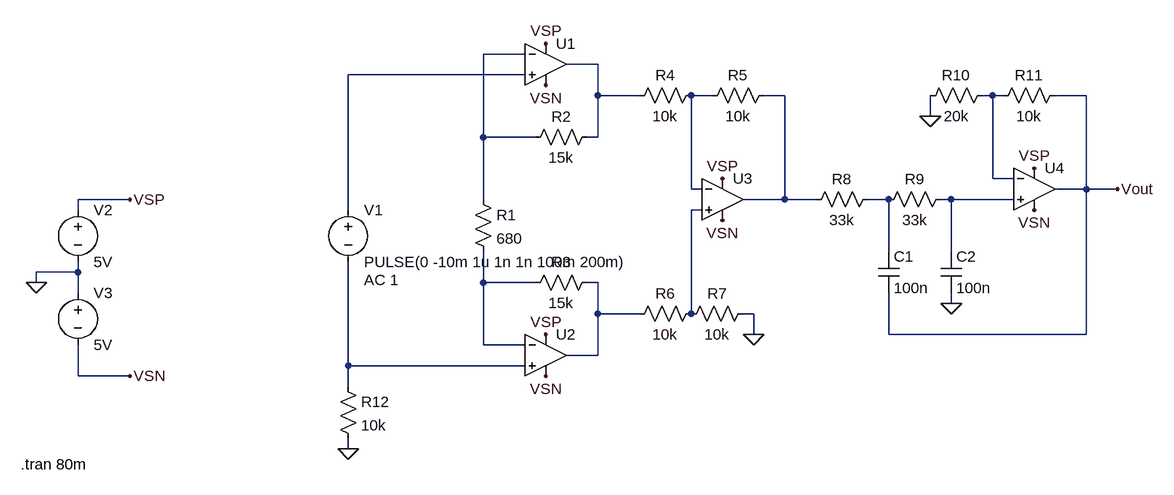
[diagram p0: schematic ex4.asc]
ex4.asc, the LTspice schematic file:
Version 4
SHEET 1 1612 680
WIRE 544 -208 480 -208
WIRE 656 -192 608 -192
WIRE 544 -176 272 -176
WIRE 656 -144 656 -192
WIRE 720 -144 656 -144
WIRE 832 -144 800 -144
WIRE 944 -144 912 -144
WIRE 1264 -144 1248 -144
WIRE 1280 -144 1264 -144
WIRE 1408 -144 1360 -144
WIRE 1168 -112 1168 -144
WIRE 480 -80 480 -208
WIRE 560 -80 480 -80
WIRE 656 -80 656 -144
WIRE 656 -80 640 -80
WIRE 1264 -16 1264 -144
WIRE 1296 -16 1264 -16
WIRE 800 0 800 -144
WIRE 816 0 800 0
WIRE 1408 0 1408 -144
WIRE 1408 0 1360 0
WIRE 1456 0 1408 0
WIRE -64 16 -144 16
WIRE 480 16 480 -80
WIRE 944 16 944 -144
WIRE 944 16 880 16
WIRE 992 16 944 16
WIRE 1104 16 1072 16
WIRE 1200 16 1184 16
WIRE 1296 16 1200 16
WIRE -144 32 -144 16
WIRE 272 32 272 -176
WIRE 816 32 800 32
WIRE 1104 96 1104 16
WIRE 1200 96 1200 16
WIRE -144 128 -144 112
WIRE -144 128 -208 128
WIRE -208 144 -208 128
WIRE 480 144 480 96
WIRE 560 144 480 144
WIRE 656 144 640 144
WIRE -144 160 -144 128
WIRE 1200 176 1200 160
WIRE 656 192 656 144
WIRE 720 192 656 192
WIRE 800 192 800 32
WIRE 896 192 880 192
WIRE 896 224 896 192
WIRE 1104 224 1104 160
WIRE 1408 224 1408 0
WIRE 1408 224 1104 224
WIRE 480 240 480 144
WIRE 544 240 480 240
WIRE 656 256 656 192
WIRE 656 256 608 256
WIRE 272 272 272 112
WIRE 544 272 272 272
WIRE -144 288 -144 240
WIRE -64 288 -144 288
WIRE 272 304 272 272
WIRE 272 400 272 384
FLAG -208 144 0
FLAG -64 16 VSP
FLAG -64 288 VSN
FLAG 272 400 0
FLAG 576 288 VSN
FLAG 576 -160 VSN
FLAG 576 -224 VSP
FLAG 576 224 VSP
FLAG 848 -16 VSP
FLAG 848 48 VSN
FLAG 896 224 0
FLAG 1200 176 0
FLAG 1328 -32 VSP
FLAG 1328 32 VSN
FLAG 1168 -112 0
FLAG 1456 0 Vout
SYMBOL voltage -144 16 R0
SYMATTR InstName V2
SYMATTR Value 5V
SYMBOL voltage -144 144 R0
SYMATTR InstName V3
SYMATTR Value 5V
SYMBOL res 256 288 R0
SYMATTR InstName R12
SYMATTR Value 10k
SYMBOL voltage 272 16 R0
WINDOW 123 24 124 Left 2
WINDOW 39 0 0 Left 0
SYMATTR Value2 AC 1
SYMATTR InstName V1
SYMATTR Value PULSE(0 -10m 1u 1n 1n 100m 200m)
SYMBOL res 464 0 R0
SYMATTR InstName R1
SYMATTR Value 680
SYMBOL res 656 -96 R90
WINDOW 0 0 56 VBottom 2
WINDOW 3 32 56 VTop 2
SYMATTR InstName R2
SYMATTR Value 15k
SYMBOL res 656 128 R90
WINDOW 0 0 56 VBottom 2
WINDOW 3 32 56 VTop 2
SYMATTR InstName R3
SYMATTR Value 15k
SYMBOL res 816 -160 R90
WINDOW 0 0 56 VBottom 2
WINDOW 3 32 56 VTop 2
SYMATTR InstName R4
SYMATTR Value 10k
SYMBOL res 816 176 R90
WINDOW 0 0 56 VBottom 2
WINDOW 3 32 56 VTop 2
SYMATTR InstName R6
SYMATTR Value 10k
SYMBOL res 928 -160 R90
WINDOW 0 0 56 VBottom 2
WINDOW 3 32 56 VTop 2
SYMATTR InstName R5
SYMATTR Value 10k
SYMBOL res 896 176 R90
WINDOW 0 0 56 VBottom 2
WINDOW 3 32 56 VTop 2
SYMATTR InstName R7
SYMATTR Value 10k
SYMBOL res 1088 0 R90
WINDOW 0 0 56 VBottom 2
WINDOW 3 32 56 VTop 2
SYMATTR InstName R8
SYMATTR Value 33k
SYMBOL cap 1088 96 R0
SYMATTR InstName C1
SYMATTR Value 100n
SYMBOL res 1200 0 R90
WINDOW 0 0 56 VBottom 2
WINDOW 3 32 56 VTop 2
SYMATTR InstName R9
SYMATTR Value 33k
SYMBOL cap 1184 96 R0
SYMATTR InstName C2
SYMATTR Value 100n
SYMBOL res 1264 -160 R90
WINDOW 0 0 56 VBottom 2
WINDOW 3 32 56 VTop 2
SYMATTR InstName R10
SYMATTR Value 20k
SYMBOL res 1376 -160 R90
WINDOW 0 0 56 VBottom 2
WINDOW 3 32 56 VTop 2
SYMATTR InstName R11
SYMATTR Value 10k
SYMBOL OpAmps\\UniversalOpAmp2 576 -192 R0
SYMATTR InstName U1
SYMBOL OpAmps\\UniversalOpAmp2 576 256 R0
SYMATTR InstName U2
SYMBOL OpAmps\\UniversalOpAmp2 848 16 R0
SYMATTR InstName U3
SYMBOL OpAmps\\UniversalOpAmp2 1328 0 R0
SYMATTR InstName U4
TEXT -232 424 Left 2 !.tran 80m

The netlist it stands for:
* ex4.asc
V2 VSP 0 5V
V3 0 VSN 5V
R12 N012 0 10k
V1 N003 N012 PULSE(0 -10m 1u 1n 1n 100m 200m) AC 1
R1 N001 N010 680
R2 N002 N001 15k
R3 N011 N010 15k
R4 N004 N002 10k
R6 N009 N011 10k
R5 N005 N004 10k
R7 0 N009 10k
R8 N007 N005 33k
C1 N007 Vout 100n
R9 N008 N007 33k
C2 N008 0 100n
R10 N006 0 20k
R11 Vout N006 10k
XU1 N003 N001 VSP VSN N002 level2 Avol=1Meg GBW=10Meg Slew=10Meg Ilimit=25m Rail=0 Vos=0 En=0 Enk=0 In=0 Ink=0 Rin=500Meg  ; pins In+ In- V+ V- OUT
XU2 N012 N010 VSP VSN N011 level2 Avol=1Meg GBW=10Meg Slew=10Meg Ilimit=25m Rail=0 Vos=0 En=0 Enk=0 In=0 Ink=0 Rin=500Meg  ; pins In+ In- V+ V- OUT
XU3 N009 N004 VSP VSN N005 level2 Avol=1Meg GBW=10Meg Slew=10Meg Ilimit=25m Rail=0 Vos=0 En=0 Enk=0 In=0 Ink=0 Rin=500Meg  ; pins In+ In- V+ V- OUT
XU4 N008 N006 VSP VSN Vout level2 Avol=1Meg GBW=10Meg Slew=10Meg Ilimit=25m Rail=0 Vos=0 En=0 Enk=0 In=0 Ink=0 Rin=500Meg  ; pins In+ In- V+ V- OUT
.tran 80m
.lib UniversalOpAmp2.lib
.backanno
.end